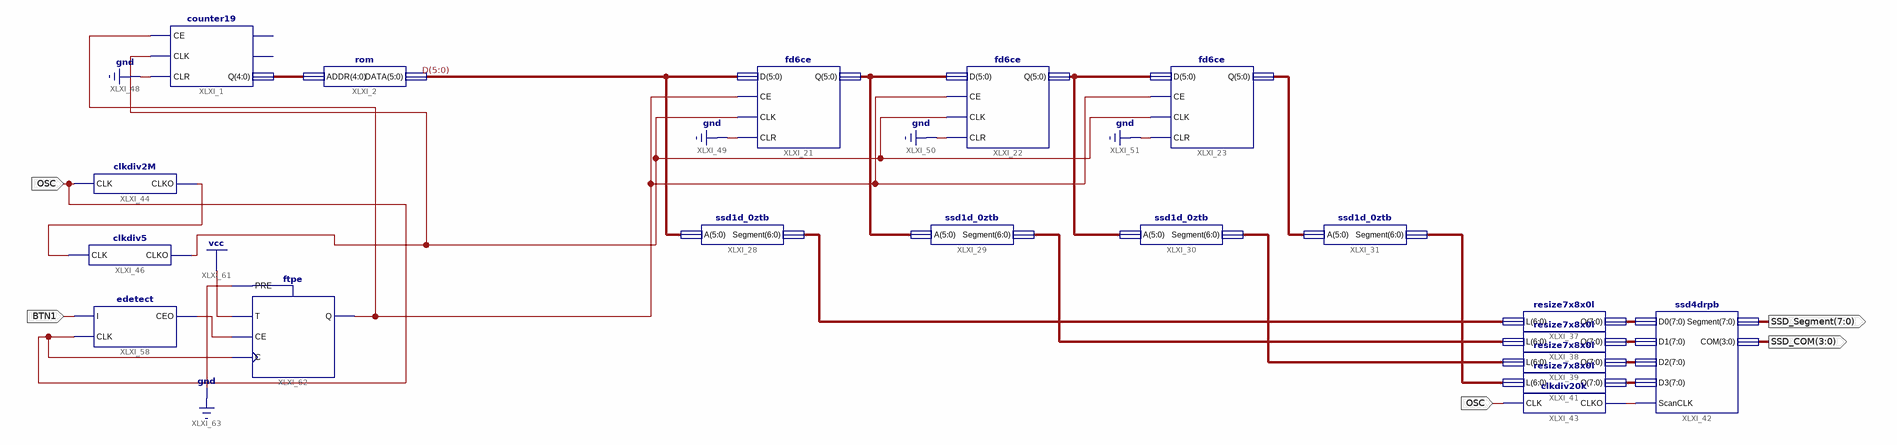
[diagram p0: schematic sheet 1]
// Xilinx ISE schematic main.sch (spartan6) as structural Verilog: 19 symbols, 4 ports
module main (
  input  OSC,
  input  BTN1,
  output [3:0] SSD_COM,
  output [7:0] SSD_Segment
);

  wire XLXN_45, XLXN_47, XLXN_49, XLXN_68, XLXN_75;
  wire [4:0] XLXN_1;
  wire [5:0] D, XLXN_78, XLXN_79, XLXN_83;
  wire [6:0] XLXN_37, XLXN_38, XLXN_39, XLXN_40;
  wire [7:0] XLXN_41, XLXN_42, XLXN_43, XLXN_44;

  counter19 XLXI_1 (.CE(XLXN_75), .CLK(XLXN_49), .CLR(1'b0), .Q(XLXN_1));  // open: CEO, TC
  rom XLXI_2 (.ADDR(XLXN_1), .DATA(D));
  fd6ce XLXI_21 (.CE(XLXN_75), .CLK(XLXN_49), .CLR(1'b0), .D(D), .Q(XLXN_78));
  fd6ce XLXI_22 (.CE(XLXN_75), .CLK(XLXN_49), .CLR(1'b0), .D(XLXN_78), .Q(XLXN_79));
  fd6ce XLXI_23 (.CE(XLXN_75), .CLK(XLXN_49), .CLR(1'b0), .D(XLXN_79), .Q(XLXN_83));
  ssd1d_0ztb XLXI_28 (.A(D), .Segment(XLXN_37));
  ssd1d_0ztb XLXI_29 (.A(XLXN_78), .Segment(XLXN_38));
  ssd1d_0ztb XLXI_30 (.A(XLXN_79), .Segment(XLXN_39));
  ssd1d_0ztb XLXI_31 (.A(XLXN_83), .Segment(XLXN_40));
  resize7x8x0l XLXI_37 (.L(XLXN_37), .O(XLXN_41));
  resize7x8x0l XLXI_38 (.L(XLXN_38), .O(XLXN_42));
  resize7x8x0l XLXI_39 (.L(XLXN_39), .O(XLXN_43));
  resize7x8x0l XLXI_41 (.L(XLXN_40), .O(XLXN_44));
  ssd4drpb XLXI_42 (
    .COM(SSD_COM), .D0(XLXN_41), .D1(XLXN_42), .D2(XLXN_43), .D3(XLXN_44), .ScanCLK(XLXN_45),
    .Segment(SSD_Segment));
  clkdiv20k XLXI_43 (.CLK(OSC), .CLKO(XLXN_45));
  clkdiv2M XLXI_44 (.CLK(OSC), .CLKO(XLXN_47));
  clkdiv5 XLXI_46 (.CLK(XLXN_47), .CLKO(XLXN_49));
  edetect XLXI_58 (.CEO(XLXN_68), .CLK(OSC), .I(BTN1));
  ftpe XLXI_62 (.C(OSC), .CE(XLXN_68), .PRE(1'b0), .T(1'b1), .Q(XLXN_75));
endmodule
